# EAGLE design balance (EAGLE 6.5.0)
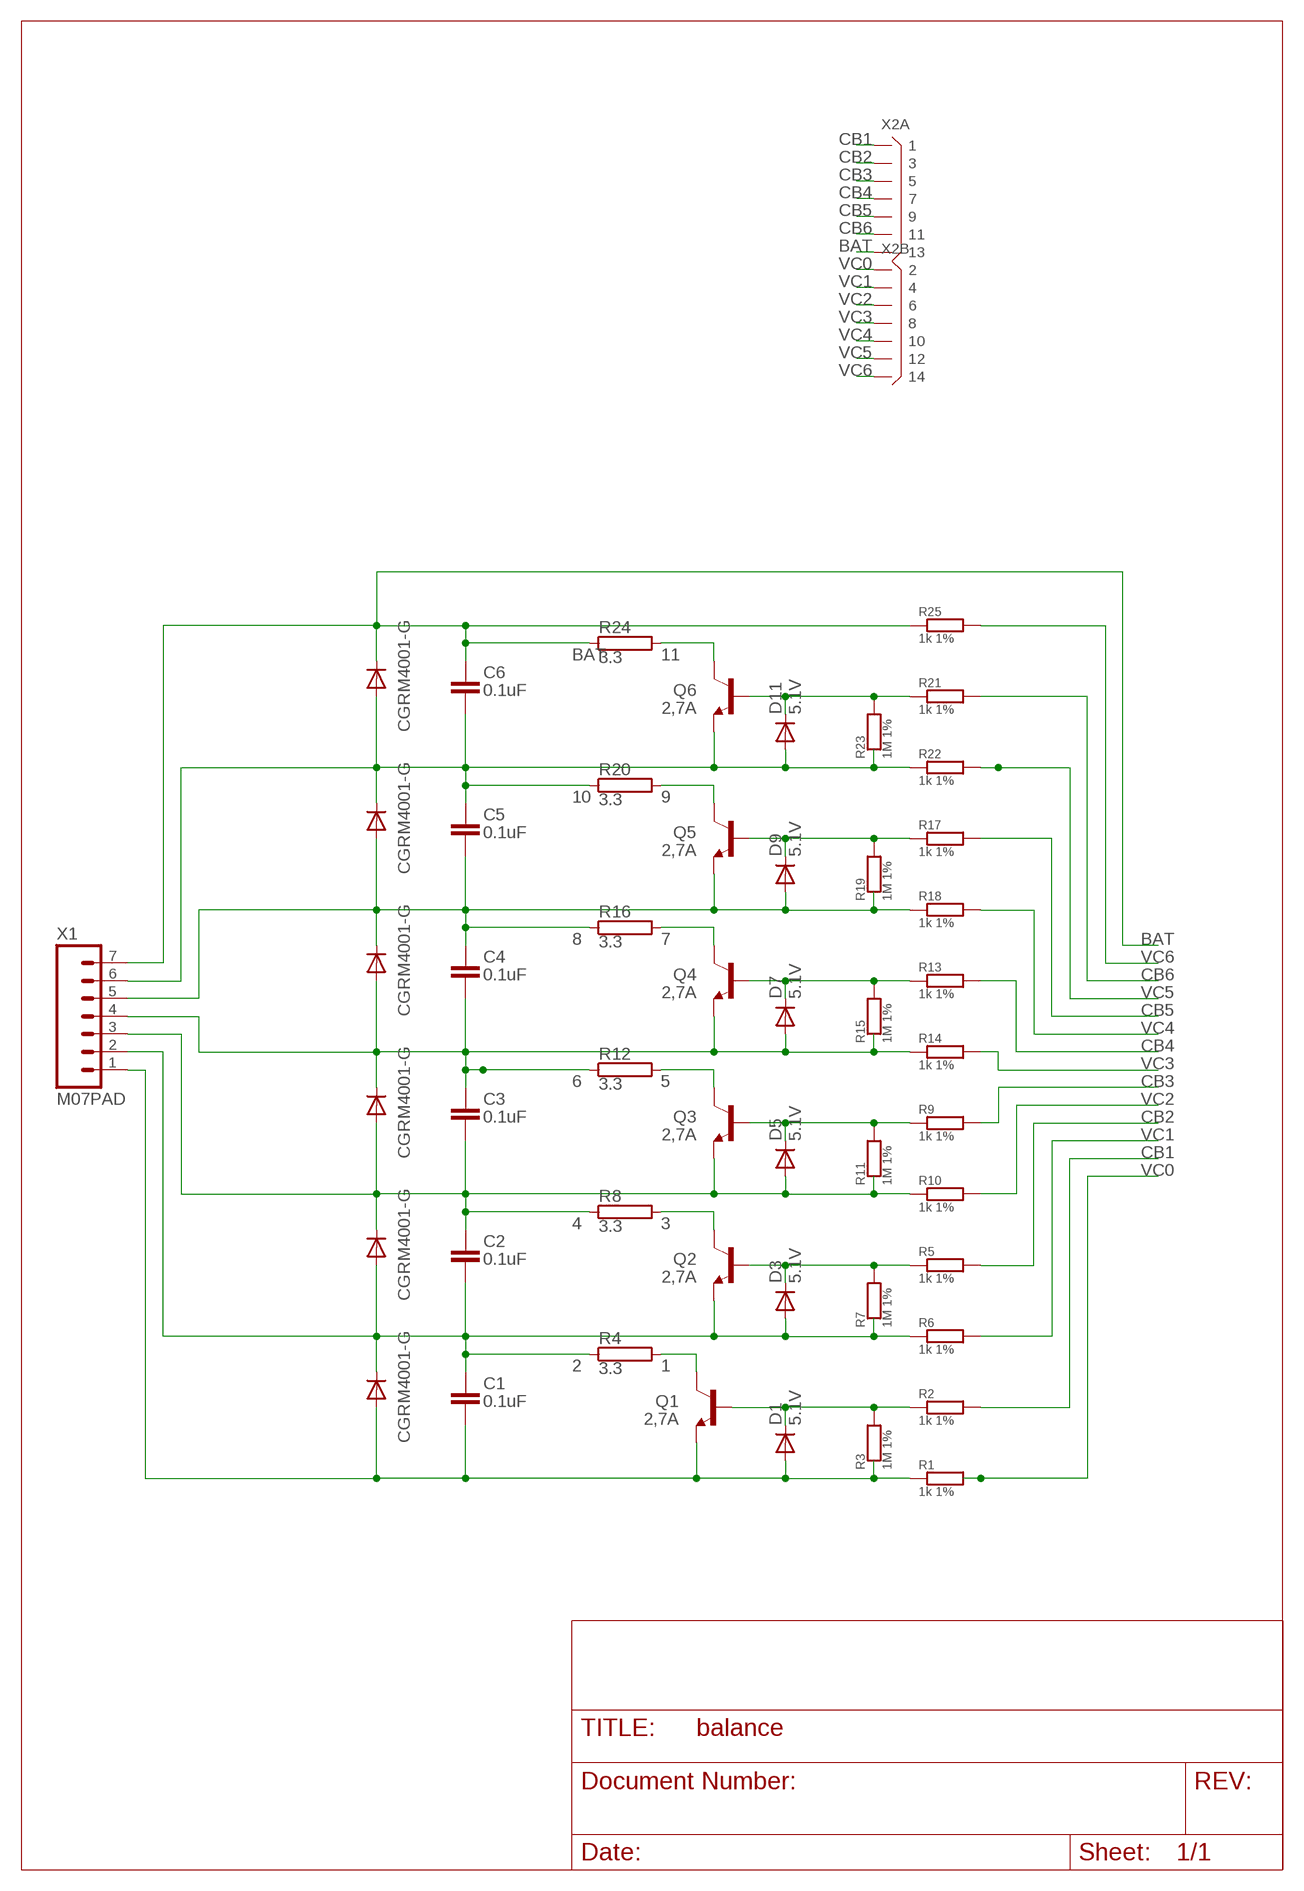
[diagram p0: schematic, sheet 1]

## Parts
C1  0.1uF  CSTD  [C0805]
C2  0.1uF  CSTD  [C0805]
C3  0.1uF  CSTD  [C0805]
C4  0.1uF  CSTD  [C0805]
C5  0.1uF  CSTD  [C0805]
C6  0.1uF  CSTD  [C0805]
D1  5.1V  DIODESOD  [SOD-323]
D2  CGRM4001-G  [SOD-123_MINI-SMA]
D3  5.1V  DIODESOD  [SOD-323]
D4  CGRM4001-G  [SOD-123_MINI-SMA]
D5  5.1V  DIODESOD  [SOD-323]
D6  CGRM4001-G  [SOD-123_MINI-SMA]
D7  5.1V  DIODESOD  [SOD-323]
D8  CGRM4001-G  [SOD-123_MINI-SMA]
D9  5.1V  DIODESOD  [SOD-323]
D10  CGRM4001-G  [SOD-123_MINI-SMA]
D11  5.1V  DIODESOD  [SOD-323]
D12  CGRM4001-G  [SOD-123_MINI-SMA]
Q1  2,7A  TRANSISTOR_NPNSOT23  [SOT23]
Q2  2,7A  TRANSISTOR_NPNSOT23  [SOT23]
Q3  2,7A  TRANSISTOR_NPNSOT23  [SOT23]
Q4  2,7A  TRANSISTOR_NPNSOT23  [SOT23]
Q5  2,7A  TRANSISTOR_NPNSOT23  [SOT23]
Q6  2,7A  TRANSISTOR_NPNSOT23  [SOT23]
R1  1k 1%  R  [R0805]
R2  1k 1%  R  [R0805]
R3  1M 1%  R  [R0805]
R4  3.3  RHS15  [HS15]
R5  1k 1%  R  [R0805]
R6  1k 1%  R  [R0805]
R7  1M 1%  R  [R0805]
R8  3.3  RHS15  [HS15]
R9  1k 1%  R  [R0805]
R10  1k 1%  R  [R0805]
R11  1M 1%  R  [R0805]
R12  3.3  RHS15  [HS15]
R13  1k 1%  R  [R0805]
R14  1k 1%  R  [R0805]
R15  1M 1%  R  [R0805]
R16  3.3  RHS15  [HS15]
R17  1k 1%  R  [R0805]
R18  1k 1%  R  [R0805]
R19  1M 1%  R  [R0805]
R20  3.3  RHS15  [HS15]
R21  1k 1%  R  [R0805]
R22  1k 1%  R  [R0805]
R23  1M 1%  R  [R0805]
R24  3.3  RHS15  [HS15]
R25  1k 1%  R  [R0805]
X1  M07PAD  [1X07]
X2  X07X2IR  [X14R-IDC]

## Nets
1: Q1.3(C) R4.2
2: C1.2 C2.1 D2.C D3.2(A) D4.A Q2.2(E) R4.1 R6.1 R7.1 X1.2
3: Q2.3(C) R8.2
4: C2.2 C3.1 D4.C D5.2(A) D6.A Q3.2(E) R8.1 R10.1 R11.1 X1.3
5: Q3.3(C) R12.2
6: C3.2 C4.1 D6.C D7.2(A) D8.A Q4.2(E) R12.1 R14.1 R15.1 X1.4
7: Q4.3(C) R16.2
8: C4.2 C5.1 D8.C D9.2(A) D10.A Q5.2(E) R16.1 R18.1 R19.1 X1.5
9: Q5.3(C) R20.2
10: C5.2 C6.1 D10.C D11.2(A) D12.A Q6.2(E) R20.1 R22.1 R23.1 X1.6
11: Q6.3(C) R24.2
BAT: C6.2 D12.C R24.1 R25.1 X1.7 X2.13
CB1: R2.2 X2.1
CB2: R5.2 X2.3
CB3: R9.2 X2.5
CB4: R13.2 X2.7
CB5: R17.2 X2.9
CB6: R21.2 X2.11
N$2: D1.1(C) Q1.1(B) R2.1 R3.2
N$4: D3.1(C) Q2.1(B) R5.1 R7.2
N$8: D5.1(C) Q3.1(B) R9.1 R11.2
N$12: D7.1(C) Q4.1(B) R13.1 R15.2
N$17: D9.1(C) Q5.1(B) R17.1 R19.2
N$21: D11.1(C) Q6.1(B) R21.1 R23.2
N$26: C1.1 D1.2(A) D2.A Q1.2(E) R1.1 R3.1 X1.1
VC0: R1.2 X2.2
VC1: R6.2 X2.4
VC2: R10.2 X2.6
VC3: R14.2 X2.8
VC4: R18.2 X2.10
VC5: R22.2 X2.12
VC6: R25.2 X2.14

## Library data of the parts
C1-C6 = useful:C
D1 D3 D5 D7 D9 D11 = SparkFun:DIODE: Diode These are standard reverse protection diodes and small signal diodes. SMA package can handle up to about 1A. SOD-323 can handle about 200mA. What the SOD-323 package when ordering, there are some mfgs out there that are 5-pin packages.
D2 D4 D6 D8 D10 D12 = diode:CGRM400*-G: Molded plasitc,JEDEC SOD-123/Mini SMA Source: Comchip CGRM4001-G.pdf
Q1-Q6 = SparkFun:TRANSISTOR_NPN: Transistor NPN BJT configuration in SOT23 package. MMBT2222 is the common NPN we use. Double check BCE configuration again layout.
R1-R3 R5-R7 R9-R11 R13-R15 R17-R19 R21-R23 R25 = useful:R
R4 R8 R12 R16 R20 R24 = resistor-power:R: Power Resitor; MF: OHMITE; MPN: RHS15KE; OC_FARNELL: 1158722; OC_NEWARK: 64K5744
X1 = stiftleisten:M07
X2 = connectors:X07X2: Connector 2x7 pins

## Board
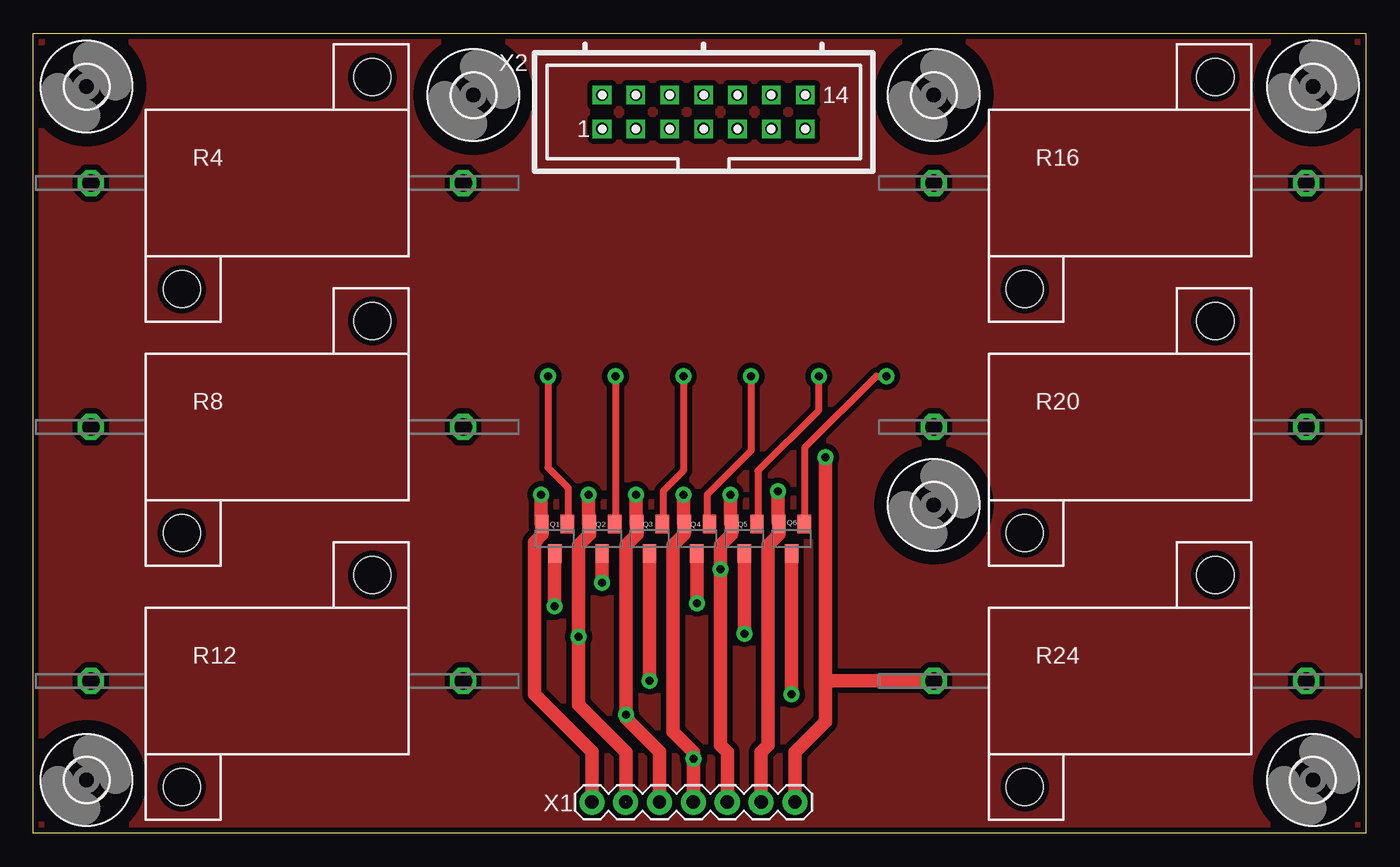
[diagram p1: board, top side]
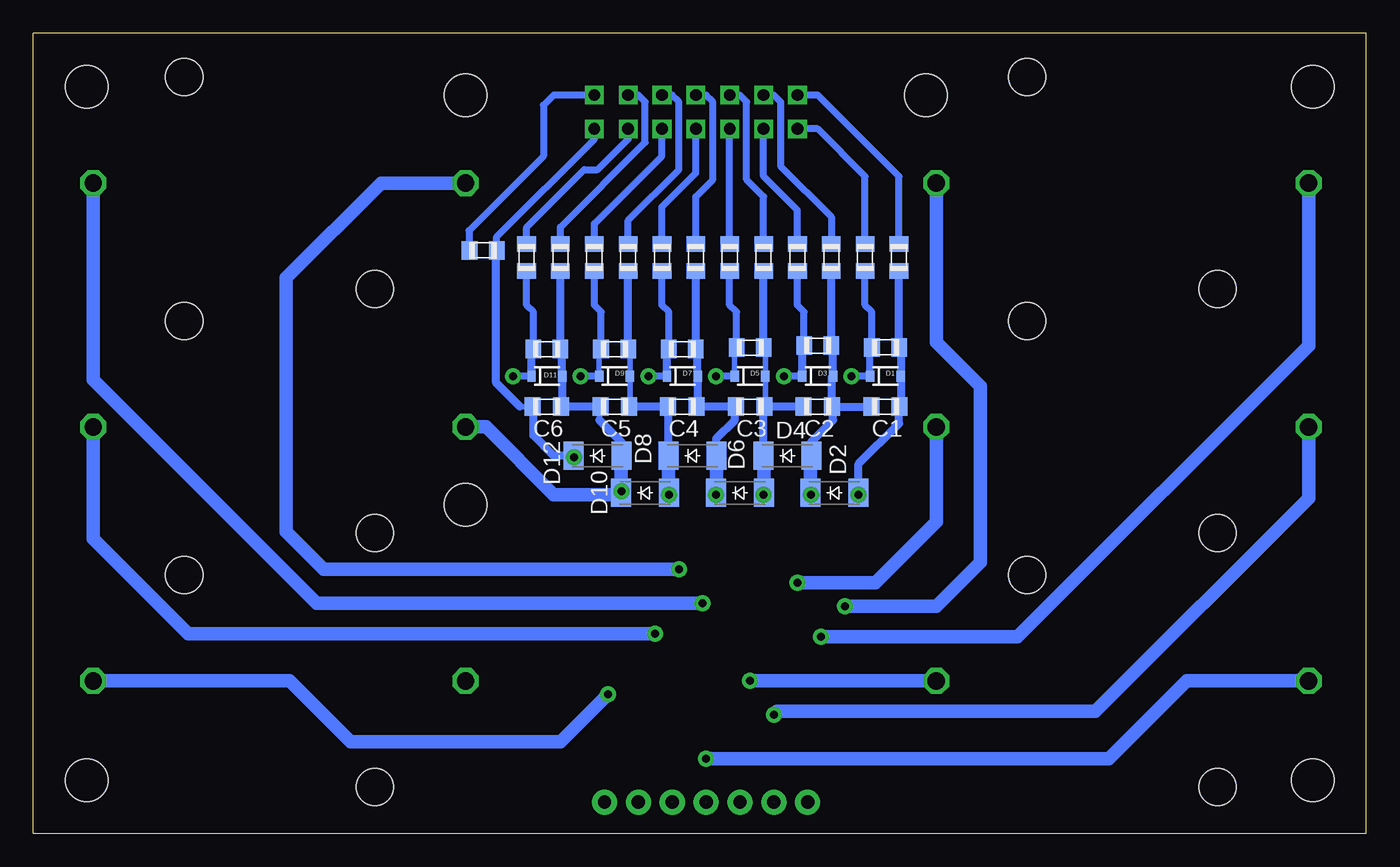
[diagram p2: board, bottom side, seen from below]

Size 100 x 60 mm. Coordinates in mm from the lower left corner, seen from the top.
Outline: 0,0 0,60 100,60 100,0 0,0
Copper layers (1+2*15+16): Top 0.035mm / dielectric 0.2mm / Route2 0.035mm / dielectric 0.5mm / Route15 0.035mm / dielectric 0.2mm / Bottom 0.035mm
Design rules "ats_35u_4layer_2": minimum track width 10mil, minimum drill 0.2mm, track to track 10mil, track to pad 10mil, pad to pad 10mil, via to via 10mil, smd to smd 10mil, copper to edge 0.3mm, drill to drill 8mil, minimum pad ring 10mil, minimum via ring 0.2mm, stop-mask expansion 4mil, vias tented up to drill 0mil, thermal gap 10mil

### Footprints (pad centres in the part's own frame; a part is rotated, then mirrored left to right if it is on the bottom)
C0805 = smd 1.2 x 1.4: 1 -1.066,0; 2 1.066,0
SOD-323 = smd 0.63 x 0.83: 1 -1.15,0; 2 1.15,0
SOD-123_MINI-SMA = smd 1.5 x 2.1: A 1.8,0; C -1.8,0
SOT23 = smd 1 x 1.4: 1 -0.95,-1.1; 2 0.95,-1.1; 3 0,1.1
R0805 = smd 1.168 x 1.397: 1 -1.016,0; 2 1.016,0
HS15 = drill 1.3 octagon: 1 -13.97,0; 2 13.97,0 | hole 2.8: -7.15,-7.95; 7.15,7.95
3,2 = hole 3.2: 0,0
1X07 = drill 1 pad 1.88: 1 0,0; 2 2.54,0; 3 5.08,0; 4 7.62,0; 5 10.16,0; 6 12.7,0; 7 15.24,0
X14R-IDC = drill 0.889 pad 1.397 square: 1 -7.62,-1.27; 2 -7.62,1.27; 3 -5.08,-1.27; 4 -5.08,1.27; 5 -2.54,-1.27; 6 -2.54,1.27; 7 0,-1.27; 8 0,1.27; 9 2.54,-1.27; 10 2.54,1.27; 11 5.08,-1.27; 12 5.08,1.27; 13 7.62,-1.27; 14 7.62,1.27

### Placement (x,y rotation side)
C1  36.07,32 180 bottom
C2  41.15,32 180 bottom
C3  46.23,32 180 bottom
C4  51.31,32 180 bottom
C5  56.39,32 180 bottom
C6  61.47,32 180 bottom
D1  36.07,34.29 0 bottom
D2  39.88,25.53 0 bottom
D3  41.15,34.29 0 bottom
D4  43.43,28.32 0 bottom
D5  46.23,34.29 0 bottom
D6  46.99,25.53 0 bottom
D7  51.31,34.29 0 bottom
D8  50.55,28.32 0 bottom
D9  56.39,34.29 0 bottom
D10  54.1,25.53 0 bottom
D11  61.47,34.29 0 bottom
D12  57.66,28.32 0 bottom
Q1  39.12,22.1 180 top
Q2  42.67,22.1 180 top
Q3  46.23,22.1 180 top
Q4  49.78,22.1 180 top
Q5  53.34,22.1 180 top
Q6  56.9,22.1 180 top
R1  35.05,43.18 90 bottom
R2  37.59,43.18 90 bottom
R3  36.07,36.45 180 bottom
R4  18.29,48.77 0 top
R5  42.67,43.18 90 bottom
R6  40.13,43.18 90 bottom
R7  41.15,36.58 180 bottom
R8  18.29,30.48 0 top
R9  47.75,43.18 90 bottom
R10  45.21,43.18 90 bottom
R11  46.22,36.44 180 bottom
R12  18.29,11.43 0 top
R13  52.83,43.18 90 bottom
R14  50.29,43.18 90 bottom
R15  51.31,36.32 180 bottom
R16  81.53,48.77 0 top
R17  57.91,43.18 90 bottom
R18  55.37,43.18 90 bottom
R19  56.39,36.32 180 bottom
R20  81.53,30.48 0 top
R21  62.99,43.18 90 bottom
R22  60.45,43.18 90 bottom
R23  61.47,36.32 180 bottom
R24  81.53,11.43 0 top
R25  66.25,43.72 180 bottom
U$1  [3,2]  4,4 0 top
U$2  [3,2]  4,56 0 top
U$3  [3,2]  96,4 0 top
U$4  [3,2]  96,56 0 top
U$5  [3,2]  67.56,55.37 0 top
U$6  [3,2]  33.02,55.37 0 top
U$7  [3,2]  67.56,24.64 0 top
X1  41.9,2.34 0 top
X2  50.29,54.1 0 top

### Tracks (layer width: path | path; a pad name or v marks a point on that pad's centre or on a via)
1  (via drill 0.6)
  Top 1.016: v39.12,17.02 Q1.3
  Bottom 1.016: R4.2 32.26,36.83 28.96,33.53 28.96,20.32 32.26,17.02 v39.12,17.02
2  (via drill 0.6)  (1 unrouted)
  Top 0.508: 41.66,23.26 Q2.2
  Top 1.016: v41.66,25.4 41.66,23.26 | Q2.2 41.72,22.42 40.89,21.59 v40.89,14.73 40.89,9.65 44.45,6.1 X1.2
  Bottom 0.406: 40,36.44 R7.1 | 41.59,25.44 D2.C | 41.68,28.28 D4.A | 40.01,31.93 C2.1 | 40.08,34.21 D3.2
  Bottom 0.508: 41.59,25.44 41.62,25.44 v41.66,25.4
  Bottom 0.61: R7.1 R6.1 | D3.2 40,36.44 | C1.2 C2.1 40.08,34.21 | D4.A 41.63,29.36 40.01,30.99 40.01,31.93
  Bottom 1.016: D2.C 41.68,28.28 | R4.1 4.32,36.58 26.16,14.73 v40.89,14.73
3  (via drill 0.6)
  Top 1.016: v42.67,18.8 Q2.3
  Bottom 1.016: R8.2 32.26,23.37 36.83,18.8 v42.67,18.8
4  (via drill 0.6)
  Top 0.508: 45.21,23.26 Q3.2
  Top 1.016: v45.21,25.4 45.21,23.26 | Q3.2 45.28,22.42 44.45,21.59 44.45,10.16 v44.45,8.89 44.45,8.64 46.98,6.1 X1.3
  Bottom 0.406: R10.1 | R11.1 45.08,36.31 D5.2 45.08,32.09 C3.1 45.23,31.93 | 45.19,28.28 D4.C
  Bottom 0.508: D6.A 45.19,25.42 v45.21,25.4
  Bottom 0.61: R11.1 R10.1 | C2.2 C3.1 | D4.C 45.23,31.93
  Bottom 1.016: D6.A 45.19,28.28 | R8.1 4.32,25.15 20.32,9.14 44.2,9.14 v44.45,8.89
5  (via drill 0.6)
  Top 1.016: Q3.3 46.23,18.54 46.23,17.78 v46.23,11.43
  Bottom 1.016: R12.2 v46.23,11.43
6  (via drill 0.6)  (1 unrouted)
  Top 0.508: 48.77,23.26 Q4.2
  Top 1.016: v48.77,25.4 48.77,23.26 | Q4.2 48.83,22.42 48.01,21.59 48.01,7.62 49.53,6.1 v49.53,5.59 X1.4
  Bottom 0.406: 50.16,36.19 R15.1 | 50.16,32.09 C4.1 | 48.75,25.57 D6.C | 47.37,31.93 C3.2
  Bottom 0.508: D6.C 48.79,25.42 v48.77,25.4
  Bottom 0.61: R15.1 R14.1 | 50.16,36.19 D7.2 50.16,32.09 | C3.2 C4.1 | D8.A 48.75,29.61 47.37,30.99 47.37,31.93
  Bottom 1.016: D8.A 48.75,25.57 | v49.53,5.59 19.3,5.59 13.46,11.43 R12.1
7  (via drill 0.6)
  Top 1.016: Q4.3 v49.78,17.27
  Bottom 1.016: v49.78,17.27 78.74,17.27 95.5,34.04 95.5,36.07 95.5,38.1 R16.2
8  (via drill 0.6)  (1 unrouted)
  Top 0.508: 52.32,23.26 Q5.2
  Top 1.016: v52.32,25.4 52.32,23.26 | Q5.2 52.39,22.42 51.56,21.59 v51.56,19.81 51.56,6.6 52.07,6.1 X1.5
  Bottom 0.406: R19.1 55.24,36.19 D9.2 55.24,32.09 C5.1 | 52.35,25.82 D10.A | 52.35,31.98 C4.2
  Bottom 0.508: D10.A 52.3,25.42 v52.32,25.4
  Bottom 0.61: R19.1 R18.1 | C4.2 C5.1 | D8.C 52.35,31.98
  Bottom 1.016: D8.C 52.35,25.82 | v51.56,19.81 78.23,19.81 81.03,22.61 81.03,41.66 73.91,48.77 R16.1
9  (via drill 0.6)
  Top 1.016: Q5.3 v53.34,14.99
  Bottom 1.016: R20.2 95.5,22.1 88.39,14.99 v53.34,14.99
10  (via drill 0.6)
  Top 0.508: 55.88,23.39 Q6.2
  Top 1.016: v55.88,25.65 55.88,23.39 | X1.6 54.6,6.09 55.12,6.6 55.12,21.59 55.95,22.42 Q6.2
  Bottom 0.406: 60.32,36.19 R23.1 | 60.32,32.09 C6.1 | 55.9,28.28 D12.A | 55.81,25.44 D10.C | 57.53,30.99 57.53,31.93 C5.2
  Bottom 0.508: 55.81,25.44 55.81,25.59 v55.88,25.65
  Bottom 0.61: R23.1 R22.1 | 60.32,36.19 D11.2 60.32,32.09 | C5.2 C6.1 | D12.A 55.86,29.32 57.53,30.99
  Bottom 1.016: 55.9,28.28 D10.C 56.03,25.4 60.96,25.4 66.04,30.48 R20.1
11  (via drill 0.6)
  Top 1.016: v56.9,10.41 Q6.3
  Bottom 1.016: R24.2 80.77,11.43 76.2,6.86 60.45,6.86 v56.9,10.41
BAT  (via drill 0.6)
  Top 1.016: v59.44,28.19 59.44,11.43 | 59.44,11.43 59.44,8.38 57.15,6.1 X1.7 | R24.1 59.44,11.43
  Bottom 0.406: 63.5,32 C6.2 62.48,31.95
  Bottom 0.508: R25.1 65.24,44.74 57.91,52.07 X2.13
  Bottom 0.61: 63.5,32 65.28,33.78 65.28,43.68 R25.1 | D12.C 60.96,28.32 62.48,29.84 62.48,31.95
  Bottom 1.016: D12.C 59.44,28.3 v59.44,28.19
CB1
  Bottom 0.508: R2.2 37.59,49.28 41.15,52.83 X2.1
CB2
  Bottom 0.508: R5.2 42.67,46.74 45.21,49.28 X2.3
CB3
  Bottom 0.508: R9.2 X2.5
CB4
  Bottom 0.508: R13.2 52.83,46.99 50.29,49.53 X2.7
CB5
  Bottom 0.508: R17.2 57.91,45.72 52.83,50.8 X2.9
CB6
  Bottom 0.508: X2.11 55.37,52.07 57.66,49.78 58.67,49.78 62.99,45.47 R21.2
N$1
  pour Top (isolate 0.406): 0,60 100,60 100,0 0,0
N$2  (via drill 0.6)
  Top 0.508: v38.61,34.29 38.61,27.43 40.13,25.91 40.13,23.26 Q1.1
  Bottom 0.508: R2.1 37.59,39.62 37.08,39.12 R3.2 37.22,36.31 D1.1 v38.61,34.29
N$4  (via drill 0.6)
  Top 0.508: v43.69,34.29 43.69,23.26 Q2.1
  Bottom 0.406: 42.3,36.44 R7.2
  Bottom 0.508: R7.2 42.16,39.12 42.67,39.62 R5.1 | D3.1 v43.69,34.29
  Bottom 0.61: D3.1 42.3,36.44
N$8  (via drill 0.6)
  Top 0.508: v48.77,34.29 48.77,27.18 47.24,25.65 47.24,23.26 Q3.1
  Bottom 0.406: D5.1 47.38,36.3 R11.2
  Bottom 0.508: R11.2 47.24,39.11 47.75,39.62 R9.1 | D5.1 v48.77,34.29
N$12  (via drill 0.6)
  Top 0.508: v53.85,34.29 53.85,28.7 50.55,25.4 50.55,23.39 Q4.1
  Bottom 0.406: 52.46,36.19 R15.2
  Bottom 0.508: R15.2 52.32,39.12 52.83,39.62 R13.1 | D7.1 v53.85,34.29
  Bottom 0.61: D7.1 52.46,36.19
N$17  (via drill 0.6)
  Top 0.508: Q5.1 54.36,23.26 54.36,27.18 58.93,31.75 v58.93,34.29
  Bottom 0.406: D9.1 57.54,36.19 R19.2
  Bottom 0.508: R19.2 57.4,39.12 57.91,39.62 R17.1 | D9.1 v58.93,34.29
N$21  (via drill 0.6)
  Top 0.508: Q6.1 57.91,23.26 57.91,28.96 63.25,34.29 v64.01,34.29
  Bottom 0.406: 62.62,36.19 R23.2
  Bottom 0.508: R23.2 62.48,39.12 62.99,39.62 R21.1 | D11.1 v64.01,34.29
  Bottom 0.61: D11.1 62.62,36.19
N$26  (via drill 0.6)
  Top 0.508: 38.1,23.26 Q1.2
  Top 1.016: v38.1,25.4 38.1,23.26 | Q1.2 38.17,22.42 37.59,21.84 37.59,10.41 41.9,6.1 X1.1
  Bottom 0.406: 34.92,32.09 C1.1 35.05,31.95 | 38.03,25.48 D2.A
  Bottom 0.508: 38.03,25.48 38.03,25.47 v38.1,25.4
  Bottom 0.61: R1.1 R3.1 34.92,36.44 D1.2 34.92,32.09 | D2.A 38.08,27.71 35.05,30.73 35.05,31.95
VC0
  Bottom 0.508: R1.2 35.05,49.28 41.15,55.37 X2.2
VC1
  Bottom 0.508: X2.4 44.45,55.37 43.94,54.86 43.94,50.04 40.13,46.23 R6.2
  Bottom 0.61: 40.11,44.22 R6.2
VC2
  Bottom 0.508: R10.2 45.21,47.75 46.48,49.02 46.48,54.86 46.99,55.37 X2.6
VC3
  Bottom 0.508: R14.2 50.29,47.75 49.02,49.02 49.02,54.86 49.53,55.37 X2.8
VC4
  Bottom 0.508: R18.2 55.37,45.97 51.56,49.78 51.56,54.86 52.07,55.37 X2.10
VC5
  Bottom 0.508: R22.2 60.45,45.47 54.1,51.82 54.1,54.86 54.61,55.37 X2.12
VC6
  Bottom 0.508: X2.14 60.96,55.37 61.72,54.61 61.72,50.8 67.31,45.21 67.31,43.76 R25.2

### Text on the board
tTest: 2,7A, 60V / 1783927 | Balancer V1 | Moni
bTest: bottom | 0.1uF | 5.1V, / 500mW